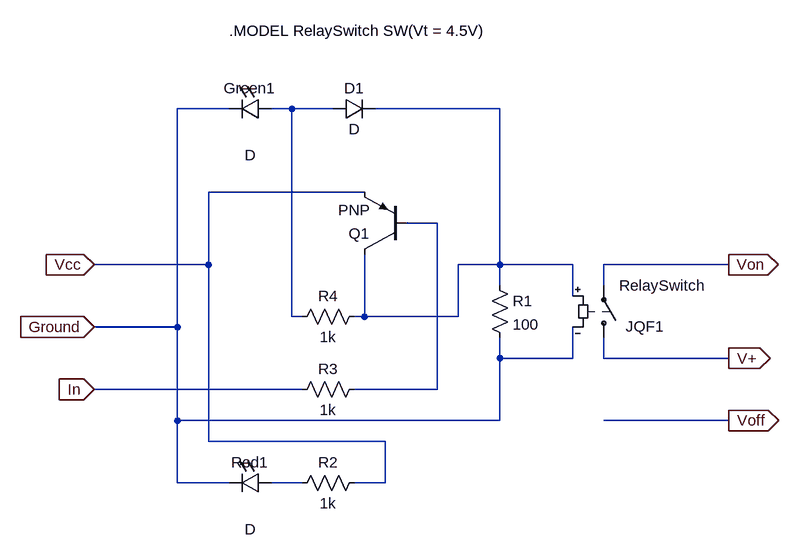
[diagram p0: schematic 3FF-S-Z-5VDC-RelayCard.asc]
3FF-S-Z-5VDC-RelayCard.asc, the LTspice schematic file:
Version 4
SHEET 1 916 680
WIRE 16 -128 -64 -128
WIRE 112 -128 80 -128
WIRE 176 -128 112 -128
WIRE 432 -128 240 -128
WIRE 224 0 -16 0
WIRE 336 48 288 48
WIRE -16 112 -16 0
WIRE -16 112 -192 112
WIRE 432 112 432 -128
WIRE 432 112 368 112
WIRE 544 112 432 112
WIRE 784 112 592 112
WIRE 432 144 432 112
WIRE 592 144 592 112
WIRE 544 160 544 112
WIRE 112 192 112 -128
WIRE 128 192 112 192
WIRE 224 192 224 96
WIRE 224 192 208 192
WIRE 368 192 368 112
WIRE 368 192 224 192
WIRE -64 208 -64 -128
WIRE -64 208 -192 208
WIRE 432 256 432 224
WIRE 544 256 544 208
WIRE 544 256 432 256
WIRE 592 256 592 224
WIRE 784 256 592 256
WIRE 128 304 -192 304
WIRE 336 304 336 48
WIRE 336 304 208 304
WIRE -64 352 -64 208
WIRE 432 352 432 256
WIRE 432 352 -64 352
WIRE 784 352 592 352
WIRE -16 384 -16 112
WIRE 256 384 -16 384
WIRE -64 448 -64 352
WIRE 16 448 -64 448
WIRE 128 448 80 448
WIRE 256 448 256 384
WIRE 256 448 208 448
FLAG -192 304 In
IOPIN -192 304 In
FLAG -192 208 Ground
IOPIN -192 208 In
FLAG -192 112 Vcc
IOPIN -192 112 In
FLAG 784 256 V+
IOPIN 784 256 Out
FLAG 784 112 Von
IOPIN 784 112 Out
FLAG 784 352 Voff
IOPIN 784 352 Out
SYMBOL sw 592 240 M180
WINDOW 0 34 33 Left 2
SYMATTR InstName JQF1
SYMATTR Value RelaySwitch
SYMBOL res 416 128 R0
SYMATTR InstName R1
SYMATTR Value 100
SYMBOL LED 80 -144 R90
WINDOW 0 0 32 VBottom 2
WINDOW 3 72 32 VTop 2
SYMATTR InstName Green1
SYMBOL diode 176 -112 R270
WINDOW 0 32 32 VTop 2
WINDOW 3 0 32 VBottom 2
SYMATTR InstName D1
SYMBOL LED 80 432 R90
WINDOW 0 0 32 VBottom 2
WINDOW 3 72 32 VTop 2
SYMATTR InstName Red1
SYMBOL res 112 464 R270
WINDOW 0 32 56 VTop 2
WINDOW 3 0 56 VBottom 2
SYMATTR InstName R2
SYMATTR Value 1k
SYMBOL res 112 320 R270
WINDOW 0 32 56 VTop 2
WINDOW 3 0 56 VBottom 2
SYMATTR InstName R3
SYMATTR Value 1k
SYMBOL pnp 288 96 R180
SYMATTR InstName Q1
SYMBOL res 112 208 R270
WINDOW 0 32 56 VTop 2
WINDOW 3 0 56 VBottom 2
SYMATTR InstName R4
SYMATTR Value 1k
TEXT 16 -248 Left 2 !.MODEL RelaySwitch SW(Vt = 4.5V)

The netlist it stands for:
* 3FF-S-Z-5VDC-RelayCard.asc
S§JQF1 V+ Von N002 Ground RelaySwitch
R1 N002 Ground 100
D§Green1 N001 Ground D
D1 N001 N002 D
D§Red1 N004 Ground D
R2 N004 Vcc 1k
R3 In N003 1k
Q1 N002 N003 Vcc 0 PNP
R4 N001 N002 1k
.model D D
.lib standard.dio
.model NPN NPN
.model PNP PNP
.lib standard.bjt
.MODEL RelaySwitch SW(Vt = 4.5V)
.backanno
.end